# Altium project SmartToy_MainBoard_REV02.PrjPcb (part 2 of 3)
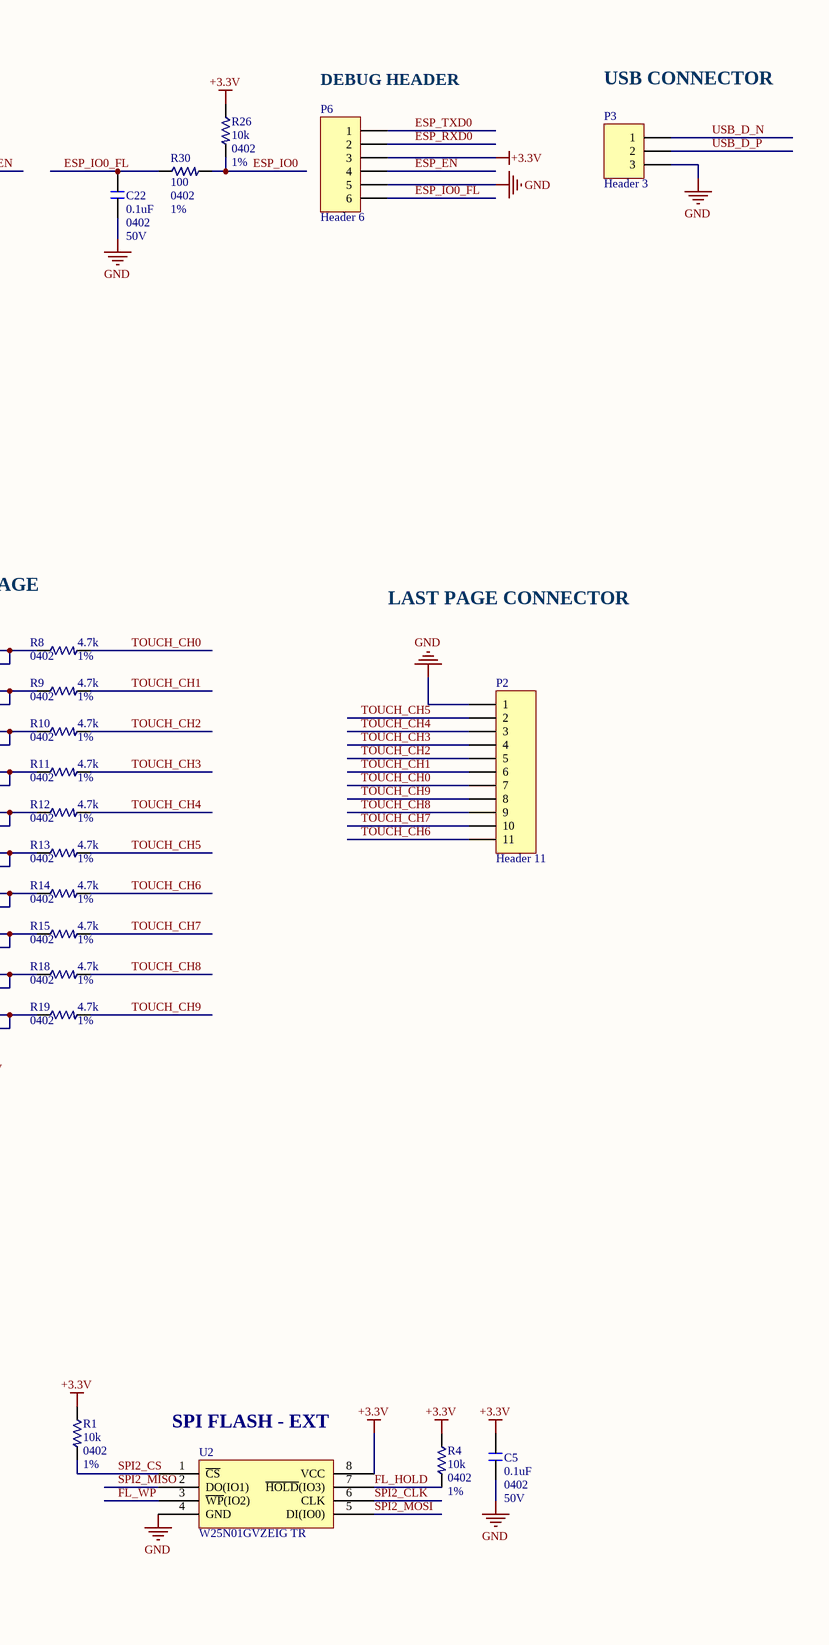
[diagram p3: SmartToy Main Board REV02 Schematic.SchDoc, right]

## Sheet SmartToy Main Board REV02 Schematic.SchDoc: Smart Toy Main Board REV01 Schematic (continued)
### Library data of the parts
C1 C2 C23 = CAP_PL: CAP ALUM 100UF 20% 16V RADIAL; Manufacturer 1: Nichicon; Manufacturer Part Number 1: UPS1C101MED; Ripple Current: 250mA; Impedance: 500mR; Life (Hours): 2000Hour; Leakage Current: 4uA; Lead Diameter: 0.5mm; Supplier 1: Digi-Key; Supplier Part Number 1: 493-15821-ND; RoHS: Yes; Category: Aluminum Electrolytic Capacitors; Stock 1: 11875; Pricing 1: 1=0.40000, 10=0.27300, 50=0.18220, 100=0.15480, 500=0.10930, 1000=0.09563, 2500=0.09108, 5000=0.08425 (USD); Mount: Through Hole; Case/Package: Radial; Min Operating Temperature: -55°C; Max Operating Temperature: 105°C; Tolerance: 20%; Capacitance: 100uF; Packaging: Bulk; Termination: Radial; Package Quantity: 200; Series: PS; Voltage: 16V; Construction: RADIAL; Diameter: 6.3mm; Height: 11mm; Lead Pitch: 2.5mm; Height - Seated (Max): 0.492inch; Radiation Hardening: No; RoHS Compliant: Yes; ComponentLink1URL: https://datasheet.ciiva.com/30527/getdatasheetpartid-388103-30527200.pdf?src-supplier=Verical; ComponentLink1Description: https://datasheet.ciiva.com/30527/getdatasheetpartid-388103-30527200.pdf?src-supplier=Verical; ComponentLink2URL: https://datasheet.ciiva.com/11777/0900766b8064973a-11777900.pdf?src-supplier=RSComponents; ComponentLink2Description: https://datasheet.ciiva.com/11777/0900766b8064973a-11777900.pdf?src-supplier=RSComponents; ComponentLink3URL: https://datasheet.ciiva.com/17525/e-ps-17525750.pdf?src-supplier=Avnet+Europe; ComponentLink3Description: https://datasheet.ciiva.com/17525/e-ps-17525750.pdf?src-supplier=Avnet+Europe; ComponentLink4URL: https://datasheet.ciiva.com/109/e-ps-109463.pdf?src-supplier=Digi-Key; ComponentLink4Description: https://datasheet.ciiva.com/109/e-ps-109463.pdf?src-supplier=Digi-Key; ComponentLink5URL: https://datasheet.ciiva.com/11686/e-ps-11686127.pdf?src-supplier=Avnet; ComponentLink5Description: https://datasheet.ciiva.com/11686/e-ps-11686127.pdf?src-supplier=Avnet
C3 C4 = CAP_CER: CAP CER 22UF 10V X5R 0603; Manufacturer: Samsung; Manufacturer Part Number: CL10A226MP8NUNE; Tolerance: 20%; Supplier 1: Digi-Key; Supplier Part Number 1: 1276-1274-1-ND; Stock 1: 62306; Pricing 1: 1 = 0.20000, 10 = 0.14300, 50 = 0.08100, 100 = 0.06720, 500 = 0.04710, 1000 = 0.03900 (USD); RoHS: Yes; Mount: Surface Mount; Case/Package: 0603; Case Code (Metric): 1608; Contact Plating: Tin; Min Operating Temperature: -55°C; Max Operating Temperature: 85°C; Packaging: Tape and Reel; Capacitance: 22uF; Length: 1.6mm; Width: 0.031inch; Height: 0.8mm; Thickness: 0.035inch; Depth: 0.8mm; Radiation Hardening: No; Lead Free: Lead Free; ComponentLink1URL: https://datasheet.ciiva.com/26838/getdatasheetpartid-746477-26838370.pdf?src-supplier=Verical; ComponentLink1Description: https://datasheet.ciiva.com/26838/getdatasheetpartid-746477-26838370.pdf?src-supplier=Verical; ComponentLink2URL: https://datasheet.ciiva.com/25711/cl10a226mp8nune-25711532.pdf?src-supplier=Digi-Key; ComponentLink2Description: https://datasheet.ciiva.com/25711/cl10a226mp8nune-25711532.pdf?src-supplier=Digi-Key
C5 C8 C14 C15 C21 C22 C24 C30 C33-C35 C37 C38 = CAP_CER: CAP CER 0.1UF 50V X7R 0402; Manufacturer: Murata; Manufacturer Part Number: GRM155R71H104KE14D; Material: Ceramic; Tolerance: 10%; Capacitance: 100nF; Dissipation Factor: 0.025%; ComponentLink1URL: https://datasheet.ciiva.com/25741/cl10b104kb8nnnl-25741341.pdf?src-supplier=Digi-Key; ComponentLink1Description: https://datasheet.ciiva.com/25741/cl10b104kb8nnnl-25741341.pdf?src-supplier=Digi-Key; ComponentLink2URL: https://datasheet.ciiva.com/26838/getdatasheetpartid-357523-26838415.pdf?src-supplier=Verical; ComponentLink2Description: https://datasheet.ciiva.com/26838/getdatasheetpartid-357523-26838415.pdf?src-supplier=Verical; Supplier 1: Digi-Key; Supplier Part Number 1: 490-10700-1-ND; Stock 1: 2282266; Pricing 1: 1 = 0.10000, 10 = 0.04600, 100 = 0.02050, 500 = 0.01464, 1000 = 0.01150, 2500 = 0.01045, 5000 = 0.00961 (USD); RoHS: Yes; Mount: Surface Mount; Weight: 0.000212oz; Case Code (Metric): 1005; Dielectric Material: Ceramic; Min Operating Temperature: -55°C; Max Operating Temperature: 125°C; Packaging: Tape and Reel; Dielectric: X7R; Voltage Rating: 50V; Termination: SMD/SMT; Composition: Ceramic; Voltage Rating (DC): 50V; Package Quantity: 10000; Length: 1mm; Height: 0.5mm; Width: 0.5mm; Thickness: 0.022inch; Depth: 0.5mm; REACH SVHC: No SVHC; Lead Free: Lead Free; ComponentLink3URL: http://www.farnell.com/datasheets/2079156.pdf?src-supplier=Farnell; ComponentLink3Description: http://www.farnell.com/datasheets/2079156.pdf?src-supplier=Farnell; ComponentLink4URL: http://www.mouser.com/ds/2/281/c02e-2905.pdf?src-supplier=Mouser; ComponentLink4Description: http://www.mouser.com/ds/2/281/c02e-2905.pdf?src-supplier=Mouser; ComponentLink5URL: http://components.arrow.com/part/dataview/0323_07030614?src-supplier=Arrow+Europe; ComponentLink5Description: http://components.arrow.com/part/dataview/0323_07030614?src-supplier=Arrow+Europe; ComponentLink6URL: https://search.murata.co.jp/Ceramy/image/img/A01X/G101/ENG/GRM155R71H104KE14-01.pdf?src-supplier=Digi-Key; ComponentLink6Description: https://search.murata.co.jp/Ceramy/image/img/A01X/G101/ENG/GRM155R71H104KE14-01.pdf?src-supplier=Digi-Key; ComponentLink7URL: http://psearch.en.murata.com/capacitor/product/GRM155R71H104KE14%23.pdf?src-supplier=Avnet; ComponentLink7Description: http://psearch.en.murata.com/capacitor/product/GRM155R71H104KE14%23.pdf?src-supplier=Avnet; ComponentLink8URL: http://www.farnell.com/datasheets/2079156.pdf?src-supplier=Element14; ComponentLink8Description: http://www.farnell.com/datasheets/2079156.pdf?src-supplier=Element14; ComponentLink9URL: http://www.farnell.com/datasheets/2079156.pdf?src-supplier=Newark; ComponentLink9Description: http://www.farnell.com/datasheets/2079156.pdf?src-supplier=Newark
  C5 C8 C21 C22 C24 C30 C33-C35 C37 C38: Case/Package: 0402
  C14 C15: Case Code (Imperial): 0402
C6 = CAP_CER: CAP CER 10UF 16V X5R 0603; Manufacturer: Taiyo Yuden; Manufacturer Part Number: EMK107BBJ106MA-T; Tolerance: 20%; Supplier 1: Digi-Key; Supplier Part Number 1: 587-3238-1-ND; RoHS: Yes; Category: Ceramic Capacitors; Stock 1: 599529; Pricing 1: 1=0.34000, 10=0.23400, 50=0.16400, 100=0.14060, 500=0.10544, 1000=0.08903 (USD); Mount: Surface Mount; Case Code (Metric): 1608; Case Code (Imperial): 0603; Min Operating Temperature: -55°C; Max Operating Temperature: 85°C; Capacitance: 10uF; Dielectric: X5R; Packaging: Tape and Reel; Voltage Rating: 16V; Package Quantity: 1; Termination: SMD/SMT; Series: M; Construction: Flat; Length: 0.063inch; Width: 0.031inch; Height: 0.8mm; Thickness: 0.031inch; RoHS Compliant: Yes; REACH SVHC: Unknown; Halogen Free: Halogen Free; ComponentLink1URL: https://datasheet.ciiva.com/6259/emk107bbj106ma-t-6259169.pdf?src-supplier=Digi-Key; ComponentLink1Description: https://datasheet.ciiva.com/6259/emk107bbj106ma-t-6259169.pdf?src-supplier=Digi-Key; ComponentLink2URL: https://datasheet.ciiva.com/15920/3emk107bbj106ma-t-15920482.pdf?src-supplier=Onlinecomponents.com; ComponentLink2Description: https://datasheet.ciiva.com/15920/3emk107bbj106ma-t-15920482.pdf?src-supplier=Onlinecomponents.com; ComponentLink3URL: https://datasheet.ciiva.com/34372/463emk107bbj106ma-t-34372674.pdf?src-supplier=Onlinecomponents.com; ComponentLink3Description: https://datasheet.ciiva.com/34372/463emk107bbj106ma-t-34372674.pdf?src-supplier=Onlinecomponents.com; ComponentLink4URL: https://datasheet.ciiva.com/6259/emk107bbj106ma-t-6259164.pdf?src-supplier=Digi-Key; ComponentLink4Description: https://datasheet.ciiva.com/6259/emk107bbj106ma-t-6259164.pdf?src-supplier=Digi-Key; ComponentLink5URL: https://datasheet.ciiva.com/6259/emk107bbj106ma-t-6259167.pdf?src-supplier=Digi-Key; ComponentLink5Description: https://datasheet.ciiva.com/6259/emk107bbj106ma-t-6259167.pdf?src-supplier=Digi-Key; ComponentLink6URL: https://datasheet.ciiva.com/13168/mlcc01-e-13168735.pdf?src-supplier=Mouser; ComponentLink6Description: https://datasheet.ciiva.com/13168/mlcc01-e-13168735.pdf?src-supplier=Mouser
C7 C9-C12 C16-C20 = CAP_CER: CAP CER 10000PF 25V X7R 0402; Manufacturer: Samsung; Manufacturer Part Number: CL05B103KA5NNNC; Tolerance: 10%; Capacitance: 10nF; ComponentLink1URL: https://datasheet.ciiva.com/11586/upy-gphc-x7r-6-3v-to-50v-8-11586326.pdf?src-supplier=Avnet; ComponentLink1Description: https://datasheet.ciiva.com/11586/upy-gphc-x7r-6-3v-to-50v-8-11586326.pdf?src-supplier=Avnet; ComponentLink2URL: https://datasheet.ciiva.com/17434/upy-gphc-x7r-6-3v-to-50v-8-17434572.pdf?src-supplier=Avnet+Europe; ComponentLink2Description: https://datasheet.ciiva.com/17434/upy-gphc-x7r-6-3v-to-50v-8-17434572.pdf?src-supplier=Avnet+Europe; Supplier 1: Digi-Key; Supplier Part Number 1: 1276-1057-1-ND; Stock 1: 2714388; Pricing 1: 1 = 0.10000, 10 = 0.01800, 50 = 0.00960, 100 = 0.00780, 500 = 0.00558, 1000 = 0.00439, 2500 = 0.00399, 5000 = 0.00367 (USD); RoHS: Yes; Mount: Surface Mount; Case Code (Imperial): 0402; Case Code (Metric): 1005; Contact Plating: Tin; Min Operating Temperature: -55°C; Max Operating Temperature: 125°C; Dielectric: X7R; Packaging: Tape and Reel; Package Quantity: 1; Length: 1mm; Width: 0.02inch; Height: 0.5mm; Thickness: 0.022inch; Depth: 0.5mm; Radiation Hardening: No; ComponentLink3URL: https://datasheet.ciiva.com/15195/getdatasheetpartid-358612-15195635.pdf?src-supplier=Verical; ComponentLink3Description: https://datasheet.ciiva.com/15195/getdatasheetpartid-358612-15195635.pdf?src-supplier=Verical; ComponentLink4URL: https://datasheet.ciiva.com/16740/cl05b104kq5nnnc-16740683.pdf?src-supplier=Future+Electronics; ComponentLink4Description: https://datasheet.ciiva.com/16740/cl05b104kq5nnnc-16740683.pdf?src-supplier=Future+Electronics
C13 = CAP_CER: CAP CER 4.7UF 16V X5R 0402; Manufacturer: Samsung; Manufacturer Part Number: CL05A475MO5NUNC; Tolerance: 20%; ComponentLink1URL: https://datasheet.ciiva.com/25786/cl05a475mp5nrnc-25786963.pdf?src-supplier=Digi-Key; ComponentLink1Description: https://datasheet.ciiva.com/25786/cl05a475mp5nrnc-25786963.pdf?src-supplier=Digi-Key; ComponentLink2URL: https://datasheet.ciiva.com/16437/cl05b104kq5nnnc-16437353.pdf?src-supplier=Future+Electronics; ComponentLink2Description: https://datasheet.ciiva.com/16437/cl05b104kq5nnnc-16437353.pdf?src-supplier=Future+Electronics; Supplier 1: Digi-Key; Supplier Part Number 1: 1276-6836-6-ND; Stock 1: 1677309; Pricing 1: 1 = 0.45000, 10 = 0.32100, 100 = 0.21130, 500 = 0.15656, 1000 = 0.13307, 2500 = 0.12524, 5000 = 0.11741 (USD); RoHS: Yes; Mount: Surface Mount; Case Code (Imperial): 0402; Case Code (Metric): 1005; Min Operating Temperature: -55°C; Max Operating Temperature: 85°C; Packaging: Tape and Reel; Capacitance: 4.7uF; Length: 0.039inch; Width: 0.02inch; Thickness: 0.022inch; ComponentLink3URL: http://www.farnell.com/datasheets/2710653.pdf?src-supplier=Farnell; ComponentLink3Description: http://www.farnell.com/datasheets/2710653.pdf?src-supplier=Farnell; ComponentLink4URL: http://www.farnell.com/datasheets/2710653.pdf?src-supplier=Newark; ComponentLink4Description: http://www.farnell.com/datasheets/2710653.pdf?src-supplier=Newark; ComponentLink5URL: http://www.samsungsem.com/kr/support/product-search/mlcc/CL05A475MO5NUNC.jsp?src-supplier=Digi-Key; ComponentLink5Description: http://www.samsungsem.com/kr/support/product-search/mlcc/CL05A475MO5NUNC.jsp?src-supplier=Digi-Key
C25 C26 = CAP_CER: CERAMIC CAPACITOR; Mouting Technology: SMT; Pin: 2
C27 C28 = CAP_CER: CAP CER 12PF 50V C0G/NP0 0402; Manufacturer: Murata; Manufacturer Part Number: GRM1555C1H120JA01J; Tolerance: 5%; Dielectric: C0G; ComponentLink1URL: https://datasheet.ciiva.com/22698/1747438-22698389.pdf?src-supplier=Element14; ComponentLink1Description: https://datasheet.ciiva.com/22698/1747438-22698389.pdf?src-supplier=Element14; ComponentLink2URL: https://datasheet.ciiva.com/6271/grm1555c1h120ja01-01-6271078.pdf?src-supplier=Digi-Key; ComponentLink2Description: https://datasheet.ciiva.com/6271/grm1555c1h120ja01-01-6271078.pdf?src-supplier=Digi-Key; ComponentLink3URL: https://datasheet.ciiva.com/11789/0900766b80ef921d-11789079.pdf?src-supplier=RSComponents; ComponentLink3Description: https://datasheet.ciiva.com/11789/0900766b80ef921d-11789079.pdf?src-supplier=RSComponents; ComponentLink4URL: https://datasheet.ciiva.com/18184/getdatasheetpartid-316477-18184186.pdf?src-supplier=Verical; ComponentLink4Description: https://datasheet.ciiva.com/18184/getdatasheetpartid-316477-18184186.pdf?src-supplier=Verical; ComponentLink5URL: https://datasheet.ciiva.com/29200/453581-da-01-en-vs-kondensator-0402-29200129.pdf?src-supplier=Conrad; ComponentLink5Description: https://datasheet.ciiva.com/29200/453581-da-01-en-vs-kondensator-0402-29200129.pdf?src-supplier=Conrad; ComponentLink6URL: https://datasheet.ciiva.com/6271/partnumbering-e-01-6271081.pdf?src-supplier=Digi-Key; ComponentLink6Description: https://datasheet.ciiva.com/6271/partnumbering-e-01-6271081.pdf?src-supplier=Digi-Key; ComponentLink7URL: https://datasheet.ciiva.com/6271/partnumbering-e-01-6271084.pdf?src-supplier=Digi-Key; ComponentLink7Description: https://datasheet.ciiva.com/6271/partnumbering-e-01-6271084.pdf?src-supplier=Digi-Key; ComponentLink8URL: https://datasheet.ciiva.com/29538/partnumbering-e-01-29538559.pdf?src-supplier=Digi-Key; ComponentLink8Description: https://datasheet.ciiva.com/29538/partnumbering-e-01-29538559.pdf?src-supplier=Digi-Key; ComponentLink9URL: https://datasheet.ciiva.com/6271/partnumbering-e-01-6271189.pdf?src-supplier=Digi-Key; ComponentLink9Description: https://datasheet.ciiva.com/6271/partnumbering-e-01-6271189.pdf?src-supplier=Digi-Key; ComponentLink10URL: https://datasheet.ciiva.com/6271/partnumbering-e-01-6271194.pdf?src-supplier=Digi-Key; ComponentLink10Description: https://datasheet.ciiva.com/6271/partnumbering-e-01-6271194.pdf?src-supplier=Digi-Key; ComponentLink11URL: https://datasheet.ciiva.com/5437/product-5437157.pdf?src-supplier=Mouser; ComponentLink11Description: https://datasheet.ciiva.com/5437/product-5437157.pdf?src-supplier=Mouser; ComponentLink12URL: https://datasheet.ciiva.com/6271/partnumbering-e-01-6271190.pdf?src-supplier=Digi-Key; ComponentLink12Description: https://datasheet.ciiva.com/6271/partnumbering-e-01-6271190.pdf?src-supplier=Digi-Key; Supplier 1: Digi-Key; Supplier Part Number 1: 490-11375-1-ND; Stock 1: 75852; Pricing 1: 1 = 0.10000, 10 = 0.03700, 50 = 0.02040, 100 = 0.01660, 500 = 0.01186, 1000 = 0.00932, 2500 = 0.00847, 5000 = 0.00779 (USD); RoHS: Yes; Mount: Surface Mount; Case Code (Metric): 1005; Case Code (Imperial): 0402; Min Operating Temperature: -55°C; Max Operating Temperature: 125°C; Package Quantity: 50000; Packaging: Tape and Reel; Capacitance: 12pF; Voltage Rating (DC): 50V; Termination: SMD/SMT; Length: 1mm; Height: 0.5mm; Width: 0.02inch; Thickness: 0.022inch; Depth: 0.5mm; Radiation Hardening: No; ComponentLink13URL: https://datasheet.ciiva.com/11608/product-11608545.pdf?src-supplier=Avnet; ComponentLink13Description: https://datasheet.ciiva.com/11608/product-11608545.pdf?src-supplier=Avnet
C29 C31 C36 = CAP_CER: CAP CER 1UF 16V X5R 0402; Manufacturer 1: KEMET; Manufacturer Part Number 1: C0402C105M4PACTU; Mouting Technology: SMT; Dielectric Material: Ceramic; Tolerance: 20%; Pin: 2; Supplier 1: Digi-Key; Supplier Part Number 1: 399-12288-1-ND; RoHS: Yes; Category: Ceramic Capacitors; Stock 1: 30464; Pricing 1: 1=0.12000, 10=0.08400, 50=0.04760, 100=0.03950, 500=0.02770, 1000=0.02294, 2500=0.02135, 5000=0.01953 (USD); Mount: Surface Mount; Case Code (Metric): 1005; Case Code (Imperial): 0402; Min Operating Temperature: -55°C; Max Operating Temperature: 85°C; Packaging: Tape and Reel; Capacitance: 1uF; Voltage Rating (DC): 16V; Dielectric: X5R; Length: 0.039inch; Width: 0.02inch; Thickness: 0.022inch; Lead Free: Lead Free; RoHS Compliant: Yes; ComponentLink1URL: http://www.farnell.com/datasheets/2747130.pdf?src-supplier=Farnell; ComponentLink1Description: http://www.farnell.com/datasheets/2747130.pdf?src-supplier=Farnell; ComponentLink2URL: http://www.kemet.com/docfinder?Partnumber=C0402C105M4PAC7867&src-supplier=Digi-Key; ComponentLink2Description: http://www.kemet.com/docfinder?Partnumber=C0402C105M4PAC7867&src-supplier=Digi-Key; ComponentLink3URL: http://www.farnell.com/datasheets/2747130.pdf?src-supplier=Newark; ComponentLink3Description: http://www.farnell.com/datasheets/2747130.pdf?src-supplier=Newark; ComponentLink4URL: https://api.kemet.com/component-edge/download/datasheet/C0402C105M4PAC7867.pdf?src-supplier=Digi-Key; ComponentLink4Description: https://api.kemet.com/component-edge/download/datasheet/C0402C105M4PAC7867.pdf?src-supplier=Digi-Key
C32 = CAP_CER: CAP CER 100PF 50V X7R 0402; Manufacturer 1: Kyocera AVX; Manufacturer Part Number 1: 04025C101KAT2A; Mouting Technology: SMT; Tolerance: 10%; Pin: 2; Supplier 1: Digi-Key; Supplier Part Number 1: 478-1089-1-ND; RoHS: Yes; Category: Ceramic Capacitors; Stock 1: 1401008; Pricing 1: 1=0.10000, 10=0.03200, 50=0.01720, 100=0.01410, 500=0.01006, 1000=0.00791, 2500=0.00719, 5000=0.00661 (USD); Mount: Surface Mount; Number of Pins: 2; Case Code (Metric): 1005; Case Code (Imperial): 0402; Min Operating Temperature: -55°C; Max Operating Temperature: 125°C; Capacitance: 100pF; Packaging: Tape and Reel; Dielectric: X7R; Voltage Rating: 50V; Package Quantity: 1; Termination: SMD/SMT; Voltage: 50V; Series: -; Construction: Flat; Length: 1mm; Width: 0.02inch; Thickness: 0.022inch; Depth: 0.5mm; Radiation Hardening: No; REACH SVHC: No SVHC; Lead Free: Lead Free; RoHS Compliant: Yes; ComponentLink1URL: https://datasheet.ciiva.com/34303/1928935-34303276.pdf?src-supplier=Jameco; ComponentLink1Description: https://datasheet.ciiva.com/34303/1928935-34303276.pdf?src-supplier=Jameco; ComponentLink2URL: https://datasheet.ciiva.com/151/cx7r-151045.pdf?src-supplier=Digi-Key; ComponentLink2Description: https://datasheet.ciiva.com/151/cx7r-151045.pdf?src-supplier=Digi-Key; ComponentLink3URL: https://datasheet.ciiva.com/22619/1679506-22619749.pdf?src-supplier=Element14; ComponentLink3Description: https://datasheet.ciiva.com/22619/1679506-22619749.pdf?src-supplier=Element14; ComponentLink4URL: https://datasheet.ciiva.com/151/cx7r-151046.pdf?src-supplier=Digi-Key; ComponentLink4Description: https://datasheet.ciiva.com/151/cx7r-151046.pdf?src-supplier=Digi-Key; ComponentLink5URL: https://datasheet.ciiva.com/151/cx7r-151047.pdf?src-supplier=Digi-Key; ComponentLink5Description: https://datasheet.ciiva.com/151/cx7r-151047.pdf?src-supplier=Digi-Key; ComponentLink6URL: https://datasheet.ciiva.com/28453/1679506-28453959.pdf?src-supplier=Element14; ComponentLink6Description: https://datasheet.ciiva.com/28453/1679506-28453959.pdf?src-supplier=Element14; ComponentLink7URL: https://datasheet.ciiva.com/5415/cx7r-218113-5415051.pdf?src-supplier=Mouser; ComponentLink7Description: https://datasheet.ciiva.com/5415/cx7r-218113-5415051.pdf?src-supplier=Mouser; ComponentLink8URL: https://datasheet.ciiva.com/28586/1818074-28586573.pdf?src-supplier=Element14; ComponentLink8Description: https://datasheet.ciiva.com/28586/1818074-28586573.pdf?src-supplier=Element14; ComponentLink9URL: https://datasheet.ciiva.com/28586/1679506-28586589.pdf?src-supplier=Element14; ComponentLink9Description: https://datasheet.ciiva.com/28586/1679506-28586589.pdf?src-supplier=Element14; ComponentLink10URL: https://datasheet.ciiva.com/16287/cx7r-16287262.pdf?src-supplier=Future+Electronics; ComponentLink10Description: https://datasheet.ciiva.com/16287/cx7r-16287262.pdf?src-supplier=Future+Electronics
F1 = FUSE: PTC RESET FUSE 8V 1.25A 0603; Manufacturer 1: Bourns; Associated Product: 01000056Z; Supplier 1: Digi-Key; Supplier Part Number 1: MF-FSML125/8-2TR-ND; Manufacturer Part Number 1: MF-FSML125/8-2; RoHS: No; Stock 1: 6000; Pricing 1: 6000=0.53200 (USD)
FB1 FB2 = FB: FERRITE BEAD 120 OHM 0402 1LN; Manufacturer: Murata; Manufacturer Part Number: BLM15PX121SN1D; Material: Steel; Tolerance: 25%; Number of Lines: 1; DC Resistance (DCR): 55mR; Test Frequency: 100MHz; Supplier 1: Digi-Key; Supplier Part Number 1: 490-9656-1-ND; RoHS: Yes; Category: Inductors; Stock 1: 73734; Pricing 1: 1=0.12000, 10=0.09500, 25=0.07400, 50=0.06140, 100=0.05280, 250=0.04228, 500=0.03806, 1000=0.03171, 5000=0.02960 (USD); Number of Pins: 2; Case Code (Metric): 1005; Case Code (Imperial): 0402; Weight: 2.3E-05oz; Min Operating Temperature: -55°C; Max Operating Temperature: 125°C; Package Quantity: 10000; Impedance: 120R; Packaging: Tape and Reel; Max Current Rating: 2A; Termination: SMD/SMT; Max DC Current: 2A; Number of Circuits: 1; Series: EMIFIL®, BLM15P; Length: 1mm; Width: 0.5mm; Height: 0.5mm; REACH SVHC: No SVHC; Lead Free: Lead Free; RoHS Compliant: Yes; ComponentLink1URL: https://datasheet.ciiva.com/41449/001172210-da-01-en-drossel-0402-120r-1-0x0-5mm-10000st-41449498.pdf?src-supplier=Conrad; ComponentLink1Description: https://datasheet.ciiva.com/41449/001172210-da-01-en-drossel-0402-120r-1-0x0-5mm-10000st-41449498.pdf?src-supplier=Conrad; ComponentLink2URL: https://datasheet.ciiva.com/29364/l0110e-29364069.pdf?src-supplier=Digi-Key; ComponentLink2Description: https://datasheet.ciiva.com/29364/l0110e-29364069.pdf?src-supplier=Digi-Key; ComponentLink3URL: https://datasheet.ciiva.com/41860/l0110e-41860699.pdf?src-supplier=Digi-Key; ComponentLink3Description: https://datasheet.ciiva.com/41860/l0110e-41860699.pdf?src-supplier=Digi-Key
L1 = IND_SMD: FIXED IND 1UH 1.3A 82.5 MOHM SMD; Manufacturer 1: Murata; Manufacturer Part Number 1: LQM21PN1R0NGRD; Core Material: Ferrite; Tolerance: 30%; Shielding: Shielded; Self Resonant Frequency: 50MHz; DC Resistance (DCR): 82.5mR; Test Frequency: 1MHz; Supplier 1: Digi-Key; Supplier Part Number 1: 490-7780-1-ND; RoHS: Yes; Category: Fixed Inductors; Stock 1: 20158; Pricing 1: 1=0.24000, 10=0.21400, 25=0.18760, 50=0.16060, 100=0.14730, 250=0.13388, 500=0.12584, 1000=0.09639 (USD); Mount: Surface Mount; Case/Package: 0805; Case Code (Metric): 2012; Weight: 0.000194oz; Min Operating Temperature: -55°C; Max Operating Temperature: 125°C; Packaging: Tape and Reel; Package Quantity: 4000; Inductance: 1uH; Max DC Current: 1.3A; Termination: SMD/SMT; DC Current: 1.3A; Inductance Tolerance: 30%; Series: LQM21PN_GR; Length: 2mm; Width: 0.049inch; Height: 0.9mm; Height - Seated (Max): 0.039inch; Depth: 1.4mm; Military Standard: Not; REACH SVHC: No SVHC; RoHS Compliant: Yes; ComponentLink1URL: https://datasheet.ciiva.com/4965/l0075s0104lqm21p-gr-125292-4965537.pdf?src-supplier=Mouser; ComponentLink1Description: https://datasheet.ciiva.com/4965/l0075s0104lqm21p-gr-125292-4965537.pdf?src-supplier=Mouser; ComponentLink2URL: https://datasheet.ciiva.com/30490/0900766b812561d6-30490175.pdf?src-supplier=RSComponents; ComponentLink2Description: https://datasheet.ciiva.com/30490/0900766b812561d6-30490175.pdf?src-supplier=RSComponents
L2 = IND_SMD: INDUCTOR SMD
L3 = IND_SMD: FIXED IND 2NH 700MA 120 MOHM SMD; Manufacturer 1: Taiyo Yuden; Manufacturer Part Number 1: HK10052N0S-T; Core Material: Ferrite,Ceramic; Self Resonant Frequency: 6GHz; Shielding: Unshielded; DC Resistance (DCR): 120mR; Q Factor: 8; Test Frequency: 100MHz; Max DC Current: 300mA; Supplier 1: Digi-Key; Supplier Part Number 1: 587-1502-1-ND; RoHS: Yes; Category: Fixed Inductors; Stock 1: 13842; Pricing 1: 1=0.10000, 10=0.02600, 25=0.02360, 50=0.02100, 100=0.01780, 250=0.01576, 500=0.01444, 1000=0.01234, 2500=0.01102 (USD); Mount: Surface Mount; Case/Package: 0402; Number of Pins: 2; Case Code (Metric): 1005; Weight: 2.3E-05oz; Min Operating Temperature: -55°C; Max Operating Temperature: 125°C; Packaging: Tape and Reel; Inductance: 2nH; Package Quantity: 10000; Termination: SMD/SMT; Series: HK; Length: 0.039inch; Width: 0.5mm; Height: 0.5mm; Height - Seated (Max): 0.022inch; Depth: 0.55mm; Radiation Hardening: No; Lead Free: Exempt; Halogen Free: Halogen Free; REACH SVHC: No SVHC; RoHS Compliant: Yes; ComponentLink1URL: https://datasheet.ciiva.com/7153/hk10052n0s-t-ss-7153840.pdf?src-supplier=Newark; ComponentLink1Description: https://datasheet.ciiva.com/7153/hk10052n0s-t-ss-7153840.pdf?src-supplier=Newark; ComponentLink2URL: https://datasheet.ciiva.com/15986/1438hk10052n0s-t-15986357.pdf?src-supplier=Onlinecomponents.com; ComponentLink2Description: https://datasheet.ciiva.com/15986/1438hk10052n0s-t-15986357.pdf?src-supplier=Onlinecomponents.com; ComponentLink3URL: https://datasheet.ciiva.com/30105/675hk10052n0s-t-30105478.pdf?src-supplier=Onlinecomponents.com; ComponentLink3Description: https://datasheet.ciiva.com/30105/675hk10052n0s-t-30105478.pdf?src-supplier=Onlinecomponents.com; ComponentLink4URL: https://datasheet.ciiva.com/8505/hk10052n0s-t-ss-8505550.pdf?src-supplier=Avnet; ComponentLink4Description: https://datasheet.ciiva.com/8505/hk10052n0s-t-ss-8505550.pdf?src-supplier=Avnet
P1 P7 = Header 2: Header, 2-Pin; LatestRevisionDate: 17-Jul-2002; LatestRevisionNote: Re-released for DXP Platform.; Publisher: Altium Limited
P2 = Header 11: Header, 11-Pin; LatestRevisionDate: 17-Jul-2002; LatestRevisionNote: Re-released for DXP Platform.; Publisher: Altium Limited
P3 = Header 3: Header, 3-Pin; LatestRevisionDate: 17-Jul-2002; LatestRevisionNote: Re-released for DXP Platform.; Publisher: Altium Limited
P4 = Header 12: Header, 12-Pin; LatestRevisionDate: 17-Jul-2002; LatestRevisionNote: Re-released for DXP Platform.; Publisher: Altium Limited
P5 P6 = Header 6: Header, 6-Pin; LatestRevisionDate: 17-Jul-2002; LatestRevisionNote: Re-released for DXP Platform.; Publisher: Altium Limited
P8 = Header 8: Header, 8-Pin; LatestRevisionDate: 17-Jul-2002; LatestRevisionNote: Re-released for DXP Platform.; Publisher: Altium Limited
R1 R4 R25 R26 R54 R61 = RES_SMD: RES SMD 10K OHM 1% 1/16W 0402; Manufacturer: Yageo; Manufacturer Part Number: RC0402FR-0710KL; Resistance: 10kR; Temperature Coefficient: 100ppm/°C; Voltage Rating (DC): 50V; Power Rating: 62.5mW; Supplier 1: Digi-Key; RoHS: Yes; Case/Package: 0402; Number of Pins: 2; Case Code (Metric): 1005; Min Operating Temperature: -55°C; Max Operating Temperature: 155°C; Composition: Thick Film; Packaging: Tape and Reel; Voltage Rating: 50V; Termination: SMD/SMT; Military Standard: Not; Working Voltage: 50V; Number of Terminations: 2; Length: 1mm; Height: 0.32mm; Width: 0.5mm; Depth: 0.5mm; Lead Pitch: 0.2mm; REACH SVHC: No SVHC; Lead Free: Lead Free
  R1 R4 R54: ComponentLink1URL: https://datasheet.ciiva.com/7660/38590-7660789.pdf?src-supplier=Element14; ComponentLink1Description: https://datasheet.ciiva.com/7660/38590-7660789.pdf?src-supplier=Element14; ComponentLink2URL: https://datasheet.ciiva.com/15189/getdatasheetpartid-409289-15189591.pdf?src-supplier=Verical; ComponentLink2Description: https://datasheet.ciiva.com/15189/getdatasheetpartid-409289-15189591.pdf?src-supplier=Verical; ComponentLink3URL: https://datasheet.ciiva.com/46440/1868787-46440891.pdf?src-supplier=Element14; ComponentLink3Description: https://datasheet.ciiva.com/46440/1868787-46440891.pdf?src-supplier=Element14; ComponentLink4URL: https://datasheet.ciiva.com/7983/443971-7983596.pdf?src-supplier=Element14; ComponentLink4Description: https://datasheet.ciiva.com/7983/443971-7983596.pdf?src-supplier=Element14; ComponentLink5URL: https://datasheet.ciiva.com/7746/1738695-7746239.pdf?src-supplier=Element14; ComponentLink5Description: https://datasheet.ciiva.com/7746/1738695-7746239.pdf?src-supplier=Element14; ComponentLink6URL: https://datasheet.ciiva.com/22747/443971-22747519.pdf?src-supplier=Element14; ComponentLink6Description: https://datasheet.ciiva.com/22747/443971-22747519.pdf?src-supplier=Element14; Supplier Part Number 1: 311-10.0KLRCT-ND; Stock 1: 51893807; Pricing 1: 1 = 0.10000, 10 = 0.01600, 100 = 0.00640, 1000 = 0.00289, 2500 = 0.00251, 5000 = 0.00207 (USD); ComponentLink7URL: https://datasheet.ciiva.com/7660/38568-7660787.pdf?src-supplier=Element14; ComponentLink7Description: https://datasheet.ciiva.com/7660/38568-7660787.pdf?src-supplier=Element14; ComponentLink8URL: https://datasheet.ciiva.com/7849/1784430-7849813.pdf?src-supplier=Element14; ComponentLink8Description: https://datasheet.ciiva.com/7849/1784430-7849813.pdf?src-supplier=Element14; ComponentLink9URL: https://datasheet.ciiva.com/7849/1686128-7849814.pdf?src-supplier=Element14; ComponentLink9Description: https://datasheet.ciiva.com/7849/1686128-7849814.pdf?src-supplier=Element14; ComponentLink10URL: https://datasheet.ciiva.com/7849/1784430-7849815.pdf?src-supplier=Element14; ComponentLink10Description: https://datasheet.ciiva.com/7849/1784430-7849815.pdf?src-supplier=Element14; ComponentLink11URL: https://datasheet.ciiva.com/22747/1018594-22747512.pdf?src-supplier=Element14; ComponentLink11Description: https://datasheet.ciiva.com/22747/1018594-22747512.pdf?src-supplier=Element14; ComponentLink12URL: https://datasheet.ciiva.com/12667/pyu-rc0402-51-rohs-l-6-r-12667067.pdf?src-supplier=Mouser; ComponentLink12Description: https://datasheet.ciiva.com/12667/pyu-rc0402-51-rohs-l-6-r-12667067.pdf?src-supplier=Mouser; ComponentLink13URL: https://datasheet.ciiva.com/7983/1018594-7983486.pdf?src-supplier=Element14; ComponentLink13Description: https://datasheet.ciiva.com/7983/1018594-7983486.pdf?src-supplier=Element14
  R25 R26 R61: Supplier Part Number 1: 311-10.0KLRTR-ND; Stock 1: 58760000; Pricing 1: 10000 = 0.001630, 30000 = 0.001440, 50000 = 0.001320, 100000 = 0.001290 (USD); ComponentLink1URL: https://datasheet.ciiva.com/7660/38568-7660787.pdf?src-supplier=Element14; ComponentLink1Description: https://datasheet.ciiva.com/7660/38568-7660787.pdf?src-supplier=Element14; ComponentLink2URL: https://datasheet.ciiva.com/7849/1784430-7849813.pdf?src-supplier=Element14; ComponentLink2Description: https://datasheet.ciiva.com/7849/1784430-7849813.pdf?src-supplier=Element14; ComponentLink3URL: https://datasheet.ciiva.com/7849/1686128-7849814.pdf?src-supplier=Element14; ComponentLink3Description: https://datasheet.ciiva.com/7849/1686128-7849814.pdf?src-supplier=Element14; ComponentLink4URL: https://datasheet.ciiva.com/7849/1784430-7849815.pdf?src-supplier=Element14; ComponentLink4Description: https://datasheet.ciiva.com/7849/1784430-7849815.pdf?src-supplier=Element14; ComponentLink5URL: https://datasheet.ciiva.com/22747/1018594-22747512.pdf?src-supplier=Element14; ComponentLink5Description: https://datasheet.ciiva.com/22747/1018594-22747512.pdf?src-supplier=Element14; ComponentLink6URL: https://datasheet.ciiva.com/12667/pyu-rc0402-51-rohs-l-6-r-12667067.pdf?src-supplier=Mouser; ComponentLink6Description: https://datasheet.ciiva.com/12667/pyu-rc0402-51-rohs-l-6-r-12667067.pdf?src-supplier=Mouser; ComponentLink7URL: https://datasheet.ciiva.com/7983/1018594-7983486.pdf?src-supplier=Element14; ComponentLink7Description: https://datasheet.ciiva.com/7983/1018594-7983486.pdf?src-supplier=Element14
R2 = RES_SMD: RES SMD 1M OHM 1% 1/16W 0402; Manufacturer 1: Yageo; Manufacturer Part Number 1: RC0402FR-071ML; Mouting Technology: SMT; Resistance: 1MR; Power Rating: 63mW; Voltage Rating: 50V; Temperature Coefficient: 100ppm/°C; Pin: 2; Supplier 1: Digi-Key; Supplier Part Number 1: 311-1.00MLRCT-ND; RoHS: Yes; Category: Chip SMD Resistors; Stock 1: 4089105; Pricing 1: 1=0.10000, 10=0.01600, 100=0.00660, 1000=0.00299, 2500=0.00259, 5000=0.00214 (USD); Case/Package: 0402; Case Code (Imperial): 0402; Case Code (Metric): 1005; Min Operating Temperature: -55°C; Max Operating Temperature: 155°C; Resistor Type: Thick Film; Packaging: Tape and Reel; Termination: SMD/SMT; Features: Moisture Resistant; Series: RC; Max Power Dissipation: 63mW; Number of Terminations: 2; Resistance Tolerance: 1%; Construction: Rectangular; Technology: THICK FILM; Length: 1mm; Height: 0.32mm; Depth: 0.5mm; RoHS Compliant: Yes; REACH SVHC: Unknown; Military Standard: Not; Lead Free: Lead Free; ComponentLink1URL: https://datasheet.ciiva.com/11808/0900766b80c66297-11808125.pdf?src-supplier=RSComponents; ComponentLink1Description: https://datasheet.ciiva.com/11808/0900766b80c66297-11808125.pdf?src-supplier=RSComponents; ComponentLink2URL: https://datasheet.ciiva.com/46394/1018594-46394951.pdf?src-supplier=Element14; ComponentLink2Description: https://datasheet.ciiva.com/46394/1018594-46394951.pdf?src-supplier=Element14; ComponentLink3URL: https://datasheet.ciiva.com/16741/pyu-rc0402-51-rohs-l-6-r-16741081.pdf?src-supplier=Future+Electronics; ComponentLink3Description: https://datasheet.ciiva.com/16741/pyu-rc0402-51-rohs-l-6-r-16741081.pdf?src-supplier=Future+Electronics; ComponentLink4URL: https://datasheet.ciiva.com/7849/1018594-7849882.pdf?src-supplier=Element14; ComponentLink4Description: https://datasheet.ciiva.com/7849/1018594-7849882.pdf?src-supplier=Element14; ComponentLink5URL: https://datasheet.ciiva.com/7849/1018594-7849883.pdf?src-supplier=Element14; ComponentLink5Description: https://datasheet.ciiva.com/7849/1018594-7849883.pdf?src-supplier=Element14
R3 = RES_SMD: RES SMD 267k OHM 1% 1/16W 0402; Manufacturer 1: Yageo; Manufacturer Part Number 1: RC0402FR-07267KL; Mouting Technology: SMT; Resistance: 267kR; Temperature Coefficient: 100ppm/°C; Voltage Rating: 50V; Power Rating: 62.5mW; Max Power Dissipation: 63mW; Pin: 2; Supplier 1: Mouser; Supplier Part Number 1: 603-RC0402FR-07267KL; RoHS: Yes; Category: Chip SMD Resistors; Stock 1: 9880; Pricing 1: 1=0.10000, 10=0.01200, 50=0.01200, 100=0.00400, 1000=0.00400, 10000=0.00300 (USD); Contact Plating: Tin,Matte; Case Code (Imperial): 0402; Case Code (Metric): 1005; Weight: 2.3E-05oz; Min Operating Temperature: -55°C; Max Operating Temperature: 155°C; Resistor Type: Thick Film; Packaging: Tape and Reel; Number of Terminations: 2; Termination: SMD/SMT; Voltage Rating (DC): 50V; Features: Moisture Resistant; Series: RC; Construction: Rectangular; Length: 1mm; Width: 0.02inch; Height: 0.016inch; Depth: 0.5mm; Military Standard: Not; Lead Free: Lead Free; RoHS Compliant: Yes; ComponentLink1URL: https://datasheet.ciiva.com/28392/pyu-rc0402-51-rohs-l-6-28392555.pdf?src-supplier=Avnet+Europe; ComponentLink1Description: https://datasheet.ciiva.com/28392/pyu-rc0402-51-rohs-l-6-28392555.pdf?src-supplier=Avnet+Europe; ComponentLink2URL: https://datasheet.ciiva.com/26830/getdatasheetpartid-323727-26830012.pdf?src-supplier=Verical; ComponentLink2Description: https://datasheet.ciiva.com/26830/getdatasheetpartid-323727-26830012.pdf?src-supplier=Verical; ComponentLink3URL: https://datasheet.ciiva.com/8886/pyu-rc0402-51-rohs-l-6-8886495.pdf?src-supplier=Avnet; ComponentLink3Description: https://datasheet.ciiva.com/8886/pyu-rc0402-51-rohs-l-6-8886495.pdf?src-supplier=Avnet; ComponentLink4URL: https://datasheet.ciiva.com/12577/pyu-rc0402-51-rohs-l-6-r-12577167.pdf?src-supplier=Mouser; ComponentLink4Description: https://datasheet.ciiva.com/12577/pyu-rc0402-51-rohs-l-6-r-12577167.pdf?src-supplier=Mouser; ComponentLink5URL: https://datasheet.ciiva.com/16868/pyu-rc0402-51-rohs-l-6-16868735.pdf?src-supplier=Avnet+Europe; ComponentLink5Description: https://datasheet.ciiva.com/16868/pyu-rc0402-51-rohs-l-6-16868735.pdf?src-supplier=Avnet+Europe
R5 = RES_SMD: RES SMD 100K OHM 1% 1/16W 0402; Manufacturer 1: Yageo; Manufacturer Part Number 1: RC0402FR-07100KL; Mouting Technology: SMT; Resistance: 100kR; Temperature Coefficient: 100ppm/°C; Power Rating: 63mW; Voltage Rating: 50V; Pin: 2; Supplier 1: Digi-Key; Supplier Part Number 1: 311-100KLRCT-ND; RoHS: Yes; Category: Chip SMD Resistors; Stock 1: 4848920; Pricing 1: 1=0.10000, 10=0.01600, 100=0.00660, 1000=0.00299, 2500=0.00259, 5000=0.00214 (USD); Case Code (Metric): 1005; Case Code (Imperial): 0402; Min Operating Temperature: -55°C; Max Operating Temperature: 155°C; Resistor Type: Thick Film; Tolerance: 1%; Packaging: Tape and Reel; Package Quantity: 1; Number of Terminations: 2; Termination: SMD/SMT; Max Power Dissipation: 63mW; Working Voltage: 50V; Features: Moisture Resistant; Series: RC; Construction: Rectangular; Technology: THICK FILM; Length: 0.039inch; Width: 0.02inch; Height: 0.016inch; Depth: 0.5mm; REACH SVHC: No SVHC; Lead Free: Lead Free; RoHS Compliant: Yes; Military Standard: Not; ComponentLink1URL: https://datasheet.ciiva.com/11819/0900766b80c66297-11819452.pdf?src-supplier=RSComponents; ComponentLink1Description: https://datasheet.ciiva.com/11819/0900766b80c66297-11819452.pdf?src-supplier=RSComponents; ComponentLink2URL: https://datasheet.ciiva.com/2453/pyu-r-int-thick-7-2453361.pdf?src-supplier=Digi-Key; ComponentLink2Description: https://datasheet.ciiva.com/2453/pyu-r-int-thick-7-2453361.pdf?src-supplier=Digi-Key; ComponentLink3URL: https://datasheet.ciiva.com/2453/pyu-r-int-thick-7-2453362.pdf?src-supplier=Digi-Key; ComponentLink3Description: https://datasheet.ciiva.com/2453/pyu-r-int-thick-7-2453362.pdf?src-supplier=Digi-Key; ComponentLink4URL: https://datasheet.ciiva.com/2453/pyu-r-int-thick-7-2453363.pdf?src-supplier=Digi-Key; ComponentLink4Description: https://datasheet.ciiva.com/2453/pyu-r-int-thick-7-2453363.pdf?src-supplier=Digi-Key; ComponentLink5URL: https://datasheet.ciiva.com/22747/1018594-22747509.pdf?src-supplier=Element14; ComponentLink5Description: https://datasheet.ciiva.com/22747/1018594-22747509.pdf?src-supplier=Element14; ComponentLink6URL: https://datasheet.ciiva.com/15189/getdatasheetpartid-323696-15189334.pdf?src-supplier=Verical; ComponentLink6Description: https://datasheet.ciiva.com/15189/getdatasheetpartid-323696-15189334.pdf?src-supplier=Verical; ComponentLink7URL: https://datasheet.ciiva.com/12667/pyu-rc0402-51-rohs-l-6-r-12667930.pdf?src-supplier=Mouser; ComponentLink7Description: https://datasheet.ciiva.com/12667/pyu-rc0402-51-rohs-l-6-r-12667930.pdf?src-supplier=Mouser
R6-R15 R18 R19 = RES_SMD: RES SMD 4.7K OHM 1% 1/16W 0402; Manufacturer: Yageo; Manufacturer Part Number: RC0402FR-074K7L; Voltage Rating (DC): 50V; Power Rating: 62.5mW; Resistance: 4.7kR; Temperature Coefficient: 100ppm/°C; Supplier 1: Digi-Key; Supplier Part Number 1: 311-4.7KLRCT-ND; Stock 1: 10584879; Pricing 1: 1 = 0.10000, 10 = 0.01400, 100 = 0.00580, 1000 = 0.00260, 2500 = 0.00226, 5000 = 0.00186 (USD); RoHS: Yes; Case/Package: 0402; Number of Pins: 2; Case Code (Metric): 1005; Min Operating Temperature: -55°C; Max Operating Temperature: 155°C; Voltage Rating: 50V; Packaging: Tape and Reel; Resistor Type: Thick Film; Termination: SMD/SMT; Length: 1mm; Width: 0.5mm; Height: 0.32mm; Depth: 0.5mm; REACH SVHC: No SVHC; Military Standard: Not; Lead Free: Lead Free; ComponentLink1URL: https://datasheet.ciiva.com/7850/1018594-7850022.pdf?src-supplier=Element14; ComponentLink1Description: https://datasheet.ciiva.com/7850/1018594-7850022.pdf?src-supplier=Element14; ComponentLink2URL: https://datasheet.ciiva.com/7850/1018594-7850023.pdf?src-supplier=Element14; ComponentLink2Description: https://datasheet.ciiva.com/7850/1018594-7850023.pdf?src-supplier=Element14; ComponentLink3URL: https://datasheet.ciiva.com/15215/getdatasheetpartid-328119-15215035.pdf?src-supplier=Verical; ComponentLink3Description: https://datasheet.ciiva.com/15215/getdatasheetpartid-328119-15215035.pdf?src-supplier=Verical; ComponentLink4URL: https://datasheet.ciiva.com/22661/1686128-22661342.pdf?src-supplier=Element14; ComponentLink4Description: https://datasheet.ciiva.com/22661/1686128-22661342.pdf?src-supplier=Element14
R16 = RES_SMD: RES SMD 0 OHM JUMPER 1/16W 0402; Manufacturer: Yageo; Manufacturer Part Number: RC0402FR-070RL; Resistance: 0mR; Tolerance: 1%; Power Rating: 62.5mW; Voltage Rating: 50V; Temperature Coefficient: 200ppm/°C; Supplier 1: Digi-Key; Supplier Part Number 1: 311-0.0LRCT-ND; Stock 1: 3964331; Pricing 1: 1 = 0.10000, 10 = 0.01200, 25 = 0.00840, 50 = 0.00640, 100 = 0.00470, 250 = 0.00360, 500 = 0.00288, 1000 = 0.00212, 5000 = 0.00152 (USD); RoHS: Yes; Mount: Surface Mount; Case/Package: 0402; Contact Plating: Tin,Matte; Case Code (Imperial): 0402; Case Code (Metric): 1005; Min Operating Temperature: -55°C; Max Operating Temperature: 155°C; Resistor Type: Thick Film; Packaging: Tape and Reel; Termination: SMD/SMT; Length: 1mm; Width: 0.5mm; Height: 0.35mm; Radiation Hardening: No; Lead Free: Lead Free; ComponentLink1URL: https://datasheet.ciiva.com/8896/pyu-rc0402-51-rohs-l-6-8896149.pdf?src-supplier=Avnet; ComponentLink1Description: https://datasheet.ciiva.com/8896/pyu-rc0402-51-rohs-l-6-8896149.pdf?src-supplier=Avnet; ComponentLink2URL: https://datasheet.ciiva.com/16790/pyu-rc0402-51-rohs-l-6-r-16790444.pdf?src-supplier=Future+Electronics; ComponentLink2Description: https://datasheet.ciiva.com/16790/pyu-rc0402-51-rohs-l-6-r-16790444.pdf?src-supplier=Future+Electronics; ComponentLink3URL: https://datasheet.ciiva.com/28419/pyu-rc0402-51-rohs-l-6-28419661.pdf?src-supplier=Avnet+Europe; ComponentLink3Description: https://datasheet.ciiva.com/28419/pyu-rc0402-51-rohs-l-6-28419661.pdf?src-supplier=Avnet+Europe; ComponentLink4URL: https://datasheet.ciiva.com/16869/pyu-rc0402-51-rohs-l-6-16869518.pdf?src-supplier=Avnet+Europe; ComponentLink4Description: https://datasheet.ciiva.com/16869/pyu-rc0402-51-rohs-l-6-16869518.pdf?src-supplier=Avnet+Europe
R17 = RES_SMD: RES SMD 0 OHM JUMPER 1/16W 0402; Manufacturer: Yageo; Manufacturer Part Number: RC0402FR-070RL; Resistance: 0mR; Power Rating: 62.5mW; Voltage Rating: 50V; Temperature Coefficient: 200ppm/°C; Supplier 1: Digi-Key; Supplier Part Number 1: 311-0.0LRCT-ND; Stock 1: 3964331; Pricing 1: 1 = 0.10000, 10 = 0.01200, 25 = 0.00840, 50 = 0.00640, 100 = 0.00470, 250 = 0.00360, 500 = 0.00288, 1000 = 0.00212, 5000 = 0.00152 (USD); RoHS: Yes; Mount: Surface Mount; Case/Package: 0402; Contact Plating: Tin,Matte; Case Code (Metric): 1005; Min Operating Temperature: -55°C; Max Operating Temperature: 155°C; Resistor Type: Thick Film; Packaging: Tape and Reel; Termination: SMD/SMT; Length: 1mm; Width: 0.5mm; Height: 0.35mm; Radiation Hardening: No; Lead Free: Lead Free; ComponentLink1URL: https://datasheet.ciiva.com/8896/pyu-rc0402-51-rohs-l-6-8896149.pdf?src-supplier=Avnet; ComponentLink1Description: https://datasheet.ciiva.com/8896/pyu-rc0402-51-rohs-l-6-8896149.pdf?src-supplier=Avnet; ComponentLink2URL: https://datasheet.ciiva.com/16790/pyu-rc0402-51-rohs-l-6-r-16790444.pdf?src-supplier=Future+Electronics; ComponentLink2Description: https://datasheet.ciiva.com/16790/pyu-rc0402-51-rohs-l-6-r-16790444.pdf?src-supplier=Future+Electronics; ComponentLink3URL: https://datasheet.ciiva.com/28419/pyu-rc0402-51-rohs-l-6-28419661.pdf?src-supplier=Avnet+Europe; ComponentLink3Description: https://datasheet.ciiva.com/28419/pyu-rc0402-51-rohs-l-6-28419661.pdf?src-supplier=Avnet+Europe; ComponentLink4URL: https://datasheet.ciiva.com/16869/pyu-rc0402-51-rohs-l-6-16869518.pdf?src-supplier=Avnet+Europe; ComponentLink4Description: https://datasheet.ciiva.com/16869/pyu-rc0402-51-rohs-l-6-16869518.pdf?src-supplier=Avnet+Europe
R20-R22 R37-R45 = RES_SMD: RES SMD 100K OHM 1% 1/16W 0402; Manufacturer: Yageo; Manufacturer Part Number: RC0402FR-07100KL; Resistance: 100kR; Power Rating: 63mW; Voltage Rating: 50V; Temperature Coefficient: 100ppm/°C; ComponentLink1URL: https://datasheet.ciiva.com/11808/0900766b80f96399-11808107.pdf?src-supplier=RSComponents; ComponentLink1Description: https://datasheet.ciiva.com/11808/0900766b80f96399-11808107.pdf?src-supplier=RSComponents; ComponentLink2URL: https://datasheet.ciiva.com/7983/443971-7983593.pdf?src-supplier=Element14; ComponentLink2Description: https://datasheet.ciiva.com/7983/443971-7983593.pdf?src-supplier=Element14; ComponentLink3URL: https://datasheet.ciiva.com/46440/1868787-46440889.pdf?src-supplier=Element14; ComponentLink3Description: https://datasheet.ciiva.com/46440/1868787-46440889.pdf?src-supplier=Element14; ComponentLink4URL: https://datasheet.ciiva.com/7746/1738695-7746234.pdf?src-supplier=Element14; ComponentLink4Description: https://datasheet.ciiva.com/7746/1738695-7746234.pdf?src-supplier=Element14; ComponentLink5URL: https://datasheet.ciiva.com/7746/1738695-7746235.pdf?src-supplier=Element14; ComponentLink5Description: https://datasheet.ciiva.com/7746/1738695-7746235.pdf?src-supplier=Element14; ComponentLink6URL: https://datasheet.ciiva.com/22747/443971-22747516.pdf?src-supplier=Element14; ComponentLink6Description: https://datasheet.ciiva.com/22747/443971-22747516.pdf?src-supplier=Element14; Supplier 1: Digi-Key; Supplier Part Number 1: 311-100KJRCT-ND; Stock 1: 3850330; Pricing 1: 1 = 0.10000, 10 = 0.01200, 100 = 0.00480, 1000 = 0.00215, 2500 = 0.00186, 5000 = 0.00154 (USD); RoHS: Yes; Case/Package: 0402; Case Code (Metric): 1005; Min Operating Temperature: -55°C; Max Operating Temperature: 155°C; Packaging: Tape and Reel; Package Quantity: 1; Resistor Type: Thick Film; Number of Terminations: 2; Termination: SMD/SMT; Max Power Dissipation: 63mW; Features: Moisture Resistant; Length: 1mm; Width: 0.02inch; Height: 0.016inch; Depth: 0.5mm; REACH SVHC: Unknown; Military Standard: Not; Lead Free: Lead Free; ComponentLink7URL: https://datasheet.ciiva.com/7850/1018594-7850133.pdf?src-supplier=Element14; ComponentLink7Description: https://datasheet.ciiva.com/7850/1018594-7850133.pdf?src-supplier=Element14; ComponentLink8URL: https://datasheet.ciiva.com/2491/pyu-r-int-thick-7-2491207.pdf?src-supplier=Digi-Key; ComponentLink8Description: https://datasheet.ciiva.com/2491/pyu-r-int-thick-7-2491207.pdf?src-supplier=Digi-Key; ComponentLink9URL: https://datasheet.ciiva.com/2491/pyu-r-int-thick-7-2491208.pdf?src-supplier=Digi-Key; ComponentLink9Description: https://datasheet.ciiva.com/2491/pyu-r-int-thick-7-2491208.pdf?src-supplier=Digi-Key; ComponentLink10URL: https://datasheet.ciiva.com/2491/pyu-r-int-thick-7-2491209.pdf?src-supplier=Digi-Key; ComponentLink10Description: https://datasheet.ciiva.com/2491/pyu-r-int-thick-7-2491209.pdf?src-supplier=Digi-Key; ComponentLink11URL: https://datasheet.ciiva.com/17052/pyu-rc0402-51-rohs-l-6-r-17052137.pdf?src-supplier=Future+Electronics; ComponentLink11Description: https://datasheet.ciiva.com/17052/pyu-rc0402-51-rohs-l-6-r-17052137.pdf?src-supplier=Future+Electronics; ComponentLink12URL: https://datasheet.ciiva.com/12668/pyu-rc0402-51-rohs-l-6-r-12668218.pdf?src-supplier=Mouser; ComponentLink12Description: https://datasheet.ciiva.com/12668/pyu-rc0402-51-rohs-l-6-r-12668218.pdf?src-supplier=Mouser; ComponentLink13URL: https://datasheet.ciiva.com/46394/1018594-46394941.pdf?src-supplier=Element14; ComponentLink13Description: https://datasheet.ciiva.com/46394/1018594-46394941.pdf?src-supplier=Element14
R23 R24 R27 R28 R32 R34-R36 R47-R53 = RES_SMD: Surface Mount Chip Resistor, Thick Film, RC Series, 1 kohm, 62.5 mW, 1%, 50 V, 0402 [1005 Metric]; Manufacturer 1: Yageo; Manufacturer Part Number 1: RC0402FR-071KL; Mouting Technology: SMT; Resistance: 1kR; Temperature Coefficient: 100ppm/°C; Voltage Rating (DC): 50V; Power Rating: 62.5mW; Max Power Dissipation: 63mW; Pin: 2; Supplier 1: Digi-Key; Supplier Part Number 1: 311-1.00KLRCT-ND; RoHS: Yes; Category: Chip SMD Resistors; Pricing 1: 1=0.10000, 10=0.01600, 100=0.00660, 1000=0.00299, 2500=0.00259, 5000=0.00214 (USD); Case/Package: 0402; Number of Pins: 2; Case Code (Imperial): 0402; Case Code (Metric): 1005; Size Code: 0402; Min Operating Temperature: -55°C; Max Operating Temperature: 155°C; Resistor Type: Thick Film; Tolerance: 1%; Packaging: Tape and Reel; Voltage Rating: 50V; Termination: SMD/SMT; Features: Moisture Resistant; Series: RC; Number of Terminations: 2; Resistance Tolerance: 1%; Construction: Rectangular; Technology: THICK FILM; Length: 1mm; Width: 0.5mm; Height: 0.32mm; Depth: 0.5mm; REACH SVHC: Unknown; Lead Free: Lead Free; RoHS Compliant: Yes; Military Standard: Not; ComponentLink1URL: https://datasheet.ciiva.com/11819/0900766b80c66297-11819477.pdf?src-supplier=RSComponents; ComponentLink1Description: https://datasheet.ciiva.com/11819/0900766b80c66297-11819477.pdf?src-supplier=RSComponents; ComponentLink2URL: https://datasheet.ciiva.com/7983/1018594-7983502.pdf?src-supplier=Element14; ComponentLink2Description: https://datasheet.ciiva.com/7983/1018594-7983502.pdf?src-supplier=Element14; ComponentLink3URL: https://datasheet.ciiva.com/22747/1018594-22747513.pdf?src-supplier=Element14; ComponentLink3Description: https://datasheet.ciiva.com/22747/1018594-22747513.pdf?src-supplier=Element14; ComponentLink4URL: https://datasheet.ciiva.com/12666/pyu-rc0402-51-rohs-l-6-r-12666741.pdf?src-supplier=Mouser; ComponentLink4Description: https://datasheet.ciiva.com/12666/pyu-rc0402-51-rohs-l-6-r-12666741.pdf?src-supplier=Mouser; ComponentLink5URL: https://datasheet.ciiva.com/7849/1018594-7849869.pdf?src-supplier=Element14; ComponentLink5Description: https://datasheet.ciiva.com/7849/1018594-7849869.pdf?src-supplier=Element14; ComponentLink6URL: https://datasheet.ciiva.com/7849/1018594-7849871.pdf?src-supplier=Element14; ComponentLink6Description: https://datasheet.ciiva.com/7849/1018594-7849871.pdf?src-supplier=Element14; ComponentLink7URL: https://datasheet.ciiva.com/17063/pyu-rc0402-51-rohs-l-6-r-17063193.pdf?src-supplier=Future+Electronics; ComponentLink7Description: https://datasheet.ciiva.com/17063/pyu-rc0402-51-rohs-l-6-r-17063193.pdf?src-supplier=Future+Electronics